# EAGLE design main-pcb-v3.1-r (EAGLE 9.6.2)
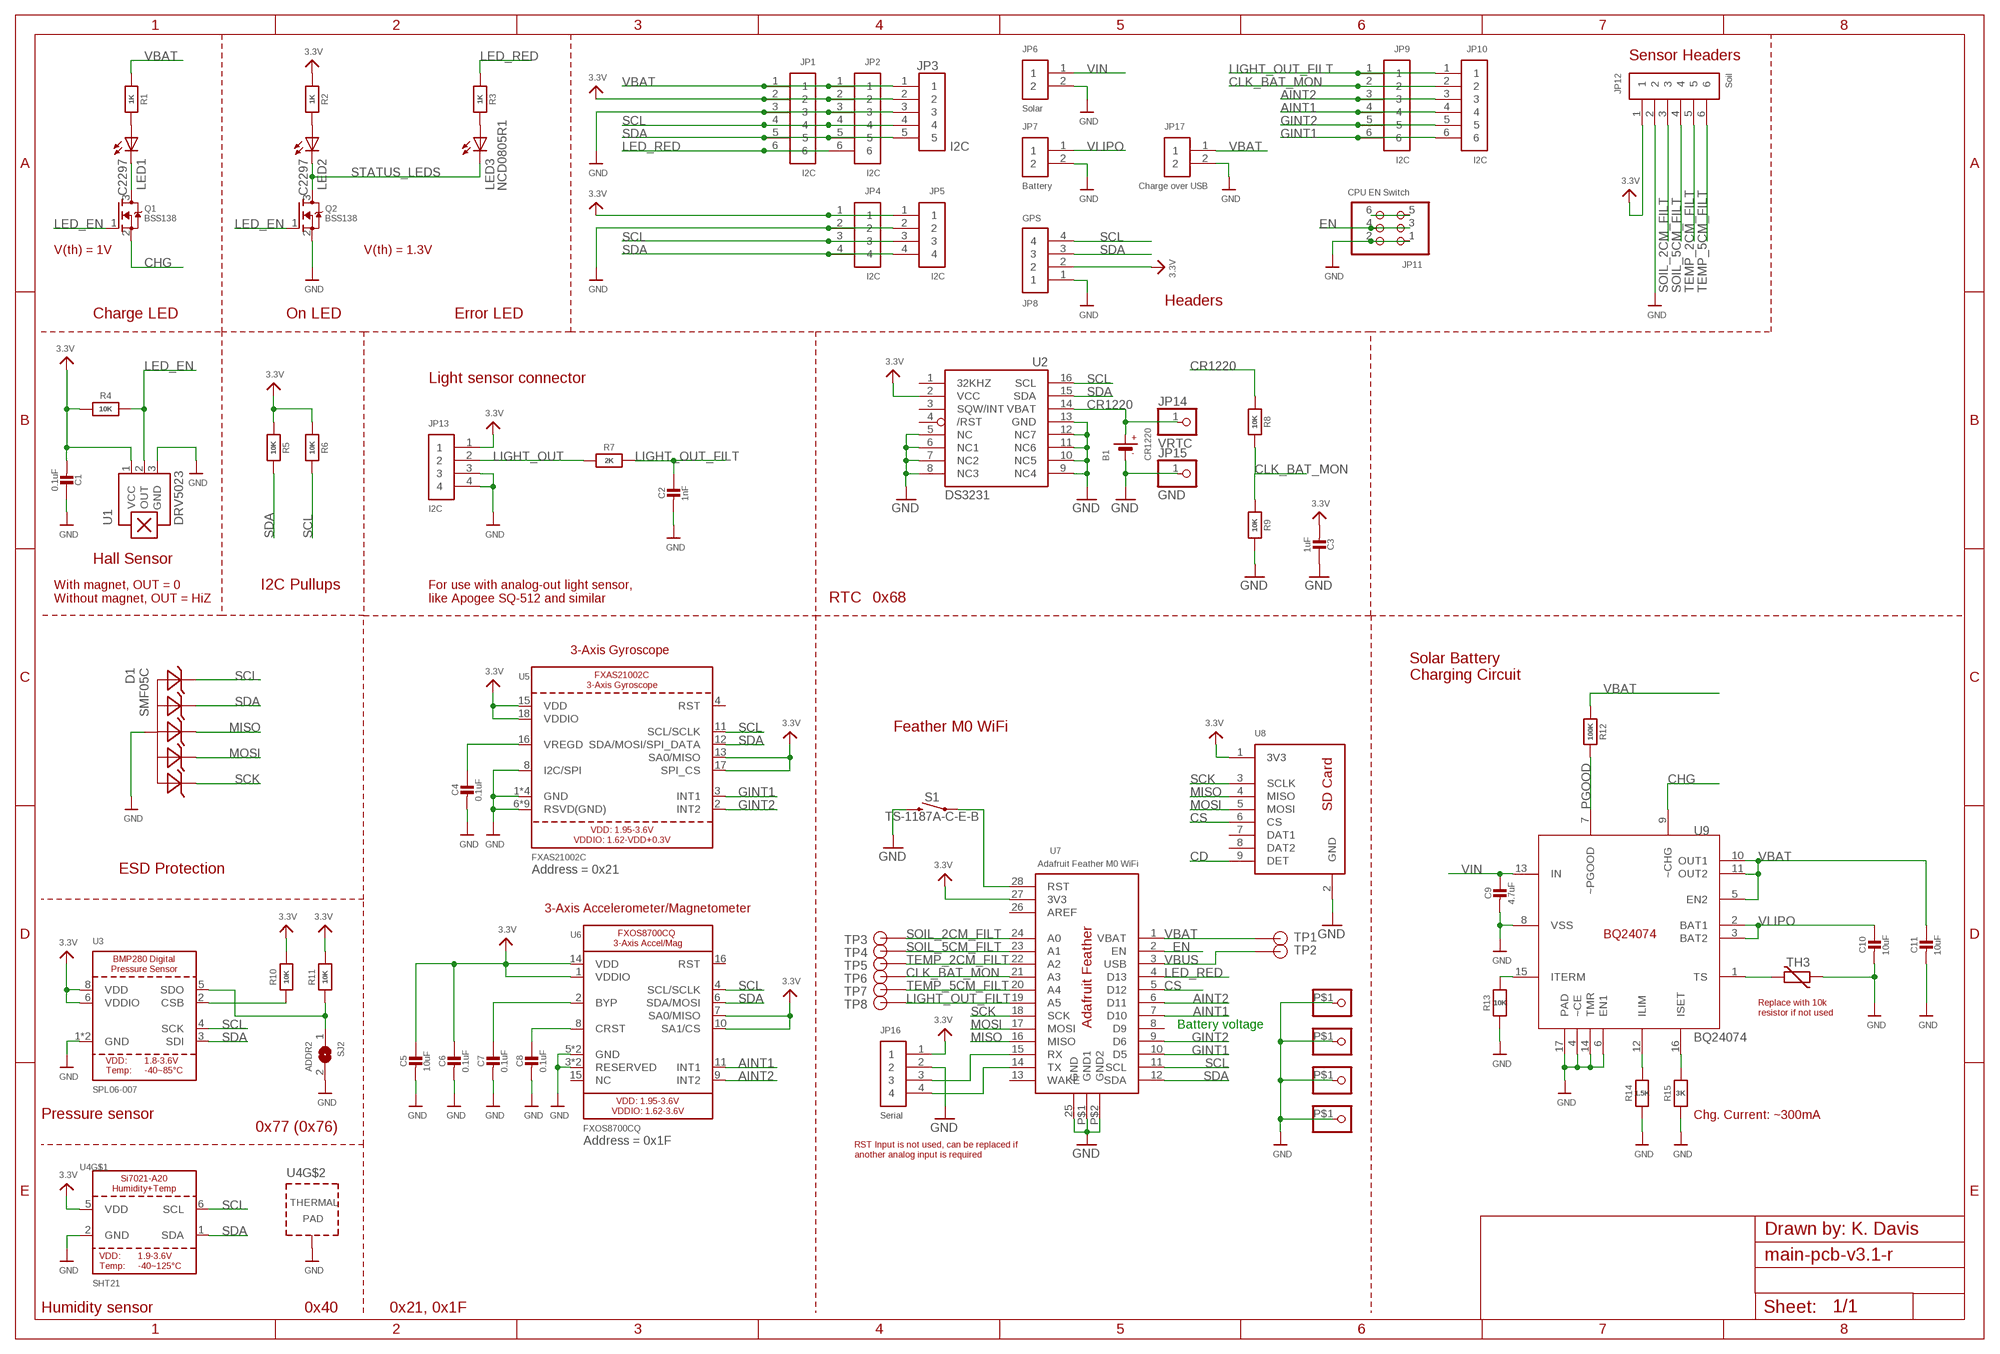
[diagram p0: schematic, sheet 1]

## Parts
B1  CR1220  BATTERYCR1220_2  [CR1220-2]
C1  0.1uF  CAP_CERAMIC0805-NOOUTLINE  [0805-NO]
C2  1nF  CAP_CERAMIC0805-NOOUTLINE  [0805-NO]
C3  1uF  CAP_CERAMIC0805-NOOUTLINE  [0805-NO]
C4  0.1uF  CAP_CERAMIC0805-NOOUTLINE  [0805-NO]
C5  10uF  CAP_CERAMIC0805-NOOUTLINE  [0805-NO]
C6  0.1uF  CAP_CERAMIC0805-NOOUTLINE  [0805-NO]
C7  0.1uF  CAP_CERAMIC0805-NOOUTLINE  [0805-NO]
C8  0.1uF  CAP_CERAMIC0805-NOOUTLINE  [0805-NO]
C9  4.7uF  CAP_CERAMIC0805-NOOUTLINE  [0805-NO]
C10  10uF  CAP_CERAMIC0805-NOOUTLINE  [0805-NO]
C11  10uF  CAP_CERAMIC0805-NOOUTLINE  [0805-NO]
D1  SMF05C  [SC70-6]
JP1  I2C  61300611121  [61300611121]
JP2  I2C  61300611121  [61300611121]
JP3  I2C  61300511121  [61300511121]
JP4  I2C  61300411121  [61300411121]
JP5  I2C  61300411121  [61300411121]
JP6  Solar  JST-2  [JST-2]
JP7  Battery  JST-2  [JST-2]
JP8  GPS  JST-4  [JST-4]
JP9  I2C  61300611121  [61300611121]
JP10  I2C  61300611121  [61300611121]
JP11  CPU EN Switch  PINHD-2X3  [2X03]
JP12  Soil  61300611121  [61300611121]
JP13  I2C  61300411121  [61300411121]
JP14  VRTC  HEADER-1X1ROUND  [1X01_ROUND]
JP15  GND  HEADER-1X1ROUND  [1X01_ROUND]
JP16  Serial  61300411121  [61300411121]
JP17  Charge over USB  JST-2  [JST-2]
LED1  C2297  LEDCHIPLED_0805  [CHIPLED_0805]
LED2  C2297  LEDCHIPLED_0805  [CHIPLED_0805]
LED3  NCD0805R1  LEDCHIPLED_0805  [CHIPLED_0805]
Q1  BSS138  MOSFET-NWIDE  [SOT23-WIDE]
Q2  BSS138  MOSFET-NWIDE  [SOT23-WIDE]
R1  1K  RESISTOR_0603_NOOUT  [0603-NO]
R2  1K  RESISTOR_0603_NOOUT  [0603-NO]
R3  1K  RESISTOR_0603_NOOUT  [0603-NO]
R4  10K  RESISTOR_0603_NOOUT  [0603-NO]
R5  10K  RESISTOR_0603_NOOUT  [0603-NO]
R6  10K  RESISTOR_0603_NOOUT  [0603-NO]
R7  2K  RESISTOR_0603_NOOUT  [0603-NO]
R8  10K  RESISTOR_0603_NOOUT  [0603-NO]
R9  10K  RESISTOR_0603_NOOUT  [0603-NO]
R10  10K  RESISTOR_0603_NOOUT  [0603-NO]
R11  10K  RESISTOR_0603_NOOUT  [0603-NO]
R12  100K  RESISTOR_0603_NOOUT  [0603-NO]
R13  10K  RESISTOR0805_NOOUTLINE  [0805-NO]
R14  1.5K  RESISTOR0805_NOOUTLINE  [0805-NO]
R15  3K  RESISTOR0805_NOOUTLINE  [0805-NO]
S1  TS-1187A-C-E-B  MOMENTARY-SWITCH-SPST-SMD-5.2MM  [TACTILE_SWITCH_SMD_5.2MM]
SJ2  ADDR2  SOLDERJUMPER  [SOLDERJUMPER_ARROW_NOPASTE]
TH3  VARISTORCN1206  [CT/CN1206]
TP1  TP  [TP_50MIL_CIRC]
TP2  TP  [TP_50MIL_CIRC]
TP3  TP  [TP_50MIL_CIRC]
TP4  TP  [TP_50MIL_CIRC]
TP5  TP  [TP_50MIL_CIRC]
TP6  TP  [TP_50MIL_CIRC]
TP7  TP  [TP_50MIL_CIRC]
TP8  TP  [TP_50MIL_CIRC]
U1  DRV5023  [SOT-23]
U2  DS3231/SO  [SO16W]
U3  SPL06-007  BMP280_COMBO  [BMX280_COMBO]
U4  SHT21  SI7021-A20  [DFN6_3X3_SI]
U5  FXAS21002C  GYRO_FXAS21002C  [QFN24_4MM_FREESCALE_7X5]
U6  FXOS8700CQ  ACCEL_MAG_FXOS8700CQ  [QFN16_3MM_FREESCALE_5X3]
U7  Adafruit Feather M0 WiFi  FEATHER  [FEATHER]
U8  SDCARD2  [SDCARD2]
U9  BQ24074  [VQFN-16_3MM]
U$1  MOUNTING  [MOUNTING]
U$17  MOUNTING  [MOUNTING]
U$19  MOUNTING  [MOUNTING]
U$21  MOUNTING  [MOUNTING]

## Nets
3.3V: C1.2 C3.2 C5.1 C6.1 JP1.2 JP2.2 JP3.2 JP4.1 JP5.1 JP8.2 JP12.1 JP13.1 JP16.1 R2.1 R4.1 R5.1 R6.1 R10.2 R11.2 U1.1(VCC) U2.2(VCC) U3.6(VDDIO) U3.8(VDD) U4.5(VDD) U5.13(SA0/MISO) U5.15(VDD) U5.17(SPI_CS) U5.18(VDDIO) U6.1(VDDIO) U6.7(SA0/MISO) U6.10(SA1/CS) U6.14(VDD) U7.27(3V3) U8.1(3V3)
AINT1: JP9.4 JP10.4 U6.11(INT1) U7.7(D10)
AINT2: JP9.3 JP10.3 U6.9(INT2) U7.6(D11)
CD: U8.9(DET)
CHG: Q1.2(S) U9.9(~CHG)
CLK_BAT_MON: JP9.2 JP10.2 R8.2 R9.1 TP6.1(TP) U7.21(A3)
CR1220: B1.+ JP14.1 R8.1 U2.14(VBAT)
CS: U7.5(D12) U8.6(CS)
EN: JP11.3 JP11.4 U7.2(EN)
GINT1: JP9.6 JP10.6 U5.3(INT1) U7.10(D5)
GINT2: JP9.5 JP10.5 U5.2(INT2) U7.9(D6)
GND: B1.- C1.1 C2.2 C3.1 C4.2 C5.2 C6.2 C7.2 C8.2 C9.2 C10.2 C11.2 D1.2(A) JP1.3 JP2.3 JP3.3 JP4.2 JP5.2 JP6.2 JP7.2 JP8.1 JP11.1 JP11.2 JP12.2 JP13.3 JP13.4 JP15.1 JP16.2 JP17.2 Q2.2(S) R9.2 R13.1 R14.1 R15.1 S1.3 SJ2.2 TH3.2 U1.3(GND) U2.5(NC) U2.6(NC1) U2.7(NC2) U2.8(NC3) U2.9(NC4) U2.10(NC5) U2.11(NC6) U2.12(NC7) U2.13(GND) U3.1(GND) U3.7(GND) U4.2(GND) U4.PAD(TP) U5.1(GND) U5.5(GND) U5.6(RSVD(GND)) U5.7(RSVD(GND)) U5.8(I2C/SPI) U5.9(RSVD(GND)) U5.10(RSVD(GND)) U5.14(GND) U5.19(GND) U5.20(RSVD(GND)) U5.21(RSVD(GND)) U5.22(RSVD(GND)) U5.23(RSVD(GND)) U5.24(RSVD(GND)) U6.3(RESERVED) U6.5(GND) U6.12(GND) U6.13(RESERVED) U7.25(GND) U7.P$1(GND1) U7.P$2(GND2) U8.2(GND) U9.4(~CE) U9.6(EN1) U9.8(VSS) U9.14(TMR) U9.17(PAD) U$1.P$1 U$17.P$1 U$19.P$1 U$21.P$1
ITERM: R13.2 U9.15(ITERM)
LED1: LED1.C Q1.3(D)
LED_EN: Q1.1(G) Q2.1(G) R4.2 U1.2(OUT)
LED_RED: JP1.6 JP2.6 R3.1 U7.4(D13)
LIGHT_OUT: JP13.2 R7.1
LIGHT_OUT_FILT: C2.1 JP9.1 JP10.1 R7.2 TP8.1(TP) U7.19(A5)
MISO: D1.4(C3) U7.16(MISO) U8.4(MISO)
MOSI: D1.5(C4) U7.17(MOSI) U8.5(MOSI)
N$1: LED2.A R2.2
N$2: LED3.A R3.2
N$3: R10.1 U3.2(CSB)
N$4: R11.1 SJ2.1 U3.5(SDO)
N$5: JP16.3 U7.15(RX)
N$6: JP11.5 JP11.6
N$9: JP16.4 U7.14(TX)
N$10: TH3.1 U9.1(TS)
N$11: S1.1 U7.28(RST)
N$13: LED1.A R1.2
N$17: R15.2 U9.16(ISET)
N$18: R14.2 U9.12(ILIM)
N$24: C4.1 U5.16(VREGD)
N$26: C7.1 U6.2(BYP)
N$27: C8.1 U6.8(CRST)
PGOOD: R12.2 U9.7(~PGOOD)
SCK: D1.6(C5) U7.18(SCK) U8.3(SCLK)
SCL: D1.1(C1) JP1.4 JP2.4 JP3.4 JP4.3 JP5.3 JP8.4 R6.2 U2.16(SCL) U3.4(SCK) U4.6(SCL) U5.11(SCL/SCLK) U6.4(SCL/SCLK) U7.11(SCL)
SDA: D1.3(C2) JP1.5 JP2.5 JP3.5 JP4.4 JP5.4 JP8.3 R5.2 U2.15(SDA) U3.3(SDI) U4.1(SDA) U5.12(SDA/MOSI/SPI_DATA) U6.6(SDA/MOSI) U7.12(SDA)
SOIL_2CM_FILT: JP12.3 TP3.1(TP) U7.24(A0)
SOIL_5CM_FILT: JP12.4 TP4.1(TP) U7.23(A1)
STATUS_LEDS: LED2.C LED3.C Q2.3(D)
TEMP_2CM_FILT: JP12.5 TP5.1(TP) U7.22(A2)
TEMP_5CM_FILT: JP12.6 TP7.1(TP) U7.20(A4)
VBAT: C11.1 JP1.1 JP2.1 JP3.1 JP17.1 R1.1 R12.1 TP1.1(TP) U7.1(VBAT) U9.5(EN2) U9.10(OUT1) U9.11(OUT2)
VBUS: TP2.1(TP) U7.3(USB)
VIN: C9.1 JP6.1 U9.13(IN)
VLIPO: C10.1 JP7.1 U9.2(BAT1) U9.3(BAT2)
Unconnected: U2.1(32KHZ) U2.3(SQW/INT) U2.4(/RST) U5.4(RST) U6.15(NC) U6.16(RST) U7.8(D9) U7.13(WAKE) U7.26(AREF) U8.7(DAT1) U8.8(DAT2)

## Notes on the sheet
- Sensor Headers
- V(th) = 1V | V(th) = 1.3V
- Headers
- Charge LED | On LED | Error LED
- Light sensor connector
- Hall Sensor
- I2C Pullups
- With magnet, OUT = 0
  Without magnet, OUT = HiZ
- For use with analog-out light sensor,
  like Apogee SQ-512 and similar
- RTC | 0x68
- 3-Axis Gyroscope
- Solar Battery
  Charging Circuit
- Feather M0 WiFi
- ESD Protection | Address = 0x21
- 3-Axis Accelerometer/Magnetometer
- Replace with 10k
  resistor if not used
- Battery voltage
- Pressure sensor | Chg. Current: ~300mA
- 0x77 (0x76)
- Address = 0x1F
- RST Input is not used, can be replaced if
  another analog input is required
- Drawn by: K. Davis
- Humidity sensor | 0x40 | 0x21, 0x1F

## Library data of the parts
B1 = microbuilder:BATTERY: CR1220 SMT - Digikey: 3001K-ND CD2032 BAT-HLD-001 - Digikey: BAT-HLD-001-ND
C1-C11 = microbuilder:CAP_CERAMIC: Ceramic Capacitors For new designs, use the packages preceded by an '_' character since they are more reliable: The following footprints should be used on most boards: _0402 - Standard footprint for regular board layouts _0603 - Standard footprint for regular board layouts _0805 - Standard footprint for regular board layouts _1206 - Standard footprint for regular board layouts For extremely tight-pitch boards where space is at a premium, the following 'micro-pitch' footprints can be used (smaller pads, no silkscreen outline, etc.): _0402MP - Micro-pitch footprint for very dense/compact boards _0603MP - Micro-pitch footprint for very dense/compact boards _0805MP - Micro-pitch footprint for very dense/compact boards _1206MP - Micro-pitch footprint for very dense/compact boards
D1 = TVS-Diode-SMF05C:SMF05C; AVAILABILITY: Unavailable; MF: ON Semiconductor; MP: SMF05C; PACKAGE: SOT-363 ON Semiconductor; PRICE: None
JP1 JP2 JP9 JP10 JP12 = EarthPodLib:61300611121: CONN HEADER VERT 5POS 2.54MM Manufacturer's datasheet <https://katalog.we-online.de/em/datasheet/6130xx11121.pdf>; CREATED_BY: PCBLayout.com; DIGI_KEY_PART_NUMBER: 732-5318-ND; MANUFACTURER: Wurth Electronics Inc.; MPN: 61300511121
JP3 = Headers:61300511121: CONN HEADER VERT 5POS 2.54MM Manufacturer's datasheet <https://katalog.we-online.de/em/datasheet/6130xx11121.pdf>; CREATED_BY: PCBLayout.com; DIGI_KEY_PART_NUMBER: 732-5318-ND; MANUFACTURER: Wurth Electronics Inc.; MPN: 61300511121
JP4 JP5 JP13 JP16 = Headers:61300411121: CONN HEADER VERT 4POS 2.54MM Manufacturer's datasheet <https://katalog.we-online.de/em/datasheet/6130xx11121.pdf>; CREATED_BY: PCBLayout.com; DIGI_KEY_PART_NUMBER: 732-5317-ND; MANUFACTURER: Wurth Electronics Inc.; MPN: 61300411121
JP6 JP7 JP17 = EarthPodLib:JST-2
JP8 = EarthPodLib:JST-4
JP11 = pinhead:PINHD-2X3: PIN HEADER
JP14 JP15 = microbuilder:HEADER-1X1: PIN HEADER
LED1-LED3 = adafruit:LED: LED OSRAM: - CHIPLED LG R971, LG N971, LY N971, LG Q971, LY Q971, LO R971, LY R971 LH N974, LH R974 LS Q976, LO Q976, LY Q976 LO Q996 - Hyper CHIPLED LW Q18S LB Q993, LB Q99A, LB R99A - SideLED LS A670, LO A670, LY A670, LG A670, LP A670 LB A673, LV A673, LT A673, LW A673 LH A674 LY A675 LS A676, LA A676, LO A676, LY A676, LW A676 LS A679, LY A679, LG A679 - Hyper Micro SIDELED® LS Y876, LA Y876, LO Y876, LY Y876 LT Y87S - SmartLED LW L88C, LW L88S LB L89C, LB L89S, LG L890 LS L89K, LO L89K, LY L89K LS L896, LA L896, LO L896, LY L896 - TOPLED LS T670, LO T670, LY T670, LG T670, LP T670 LSG T670, LSP T670, LSY T670, LOP T670, LYG T670 LG T671, LOG T671, LSG T671 LB T673, LV T673, LT T673, LW T673 LH T674 LS T676, LA T676, LO T676, LY T676, LB T676, LH T676, LSB T676, LW T676 LB T67C, LV T67C, LT T67C, LS T67K, LO T67K, LY T67K, LW E67C LS E67B, LA E67B, LO E67B, LY E67B, LB E67C, LV E67C, LT E67C LW T67C LS T679, LY T679, LG T679 LS T770, LO T770, LY T770, LG T770, LP T770 LB T773, LV T773, LT T773, LW T773 LH T774 LS E675, LA E675, LY E675, LS T675 LS T776, LA T776, LO T776, LY T776, LB T776 LHGB T686 LT T68C, LB T68C - Hyper Mini TOPLED® LB M676 - Mini TOPLED Santana® LG M470 LS M47K, LO M47K, LY M47K Source: http://www.osram.convergy.de/
Q1 Q2 = microbuilder:MOSFET-N: N-Channel Mosfet LEGEND VDS: Voltage Drain-Source ID: Drain Current RDS(ON): Drain-Source On-State Resistance VGS(TH): Gate-Source Threshold Voltage CISS: Drain-Source Input Capacitance SOT-23 Name VDS ID RDS(ON) VGS(TH) CISS Order Number 2N7002E 60V 260mA 2.5 Ohm 2.5V @ 250uA 26.7pF @ 25V 2N7002ET1GOSTR-ND BSH103 30V 850mA 400 mOhm 400mV @ 1mA 83pF @ 24V BSH103,235-ND BSS138 60V 320mA 1.6 Ohm 1.5V @ 250uA 50pF @ 10V Mouser: 771-BSS138PW115 DMN2075U-7 20V 4.2A 38 mOhm 1V @ 250 uA 594.3pF @ 10V DMN2075U-7DICT-ND * BSS138 good choice for I2C level-shifting POWERPAK 1212-8 Name VDS ID RDS(ON) VGS(TH) CISS Order Number Si7308DN 60V 6A 58 mOhm 3V @ 250uA 665pF @ 15V SI7308DN-T1-E3CT-ND
R1-R15 = microbuilder:RESISTOR: Resistors For new designs, use the packages preceded by an '_' character since they are more reliable: The following footprints should be used on most boards: _0402 - Standard footprint for regular board layouts _0603 - Standard footprint for regular board layouts _0805 - Standard footprint for regular board layouts _1206 - Standard footprint for regular board layouts For extremely tight-pitch boards where space is at a premium, the following 'micro-pitch' footprints can be used (smaller pads, no silkscreen outline, etc.): _0402MP - Micro-pitch footprint for very dense/compact boards _0603MP - Micro-pitch footprint for very dense/compact boards _0805MP - Micro-pitch footprint for very dense/compact boards _1206MP - Micro-pitch footprint for very dense/compact boards
S1 = SparkFun-Switches:MOMENTARY-SWITCH-SPST: Momentary Switch (Pushbutton) - SPST Normally-open (NO) SPST momentary switches (buttons, pushbuttons). Variants PTH-12MM - 12mm square, through-hole Momentary Pushbutton Switch - 12mm Square <https://www.sparkfun.com/products/9190> (COM-09190) PTH-6.0MM, PTH-6.0MM-KIT - 6.0mm square, through-hole Mini Pushbutton Switch <https://www.sparkfun.com/products/97> (COM-00097) KIT package intended for soldering kit's - only one side of pads' copper is exposed. PTH-RIGHT-ANGLE-KIT - Right-angle, through-hole Right Angle Tactile Button <https://www.sparkfun.com/products/10791> - Used on SparkFun BigTime Watch Kit <https://www.sparkfun.com/products/11734> SMD-12MM - 12mm square, surface-mount Tactile Button - SMD (12mm) <https://www.sparkfun.com/products/12993> (COM-12993) Used on SparkFun PicoBoard <https://www.sparkfun.com/products/11888> SMD-4.5MM - 4.5mm Square Trackball Switch Used on SparkFun Blackberry Trackballer Breakout <https://www.sparkfun.com/products/13169> SMD-4.6MMX2.8MM - 4.60mm x 2.80mm, surface mount Used on SparkFun SAMD21 Mini Breakout <https://www.sparkfun.com/products/13664> SMD-5.2MM, SMD-5.2-REDUNDANT - 5.2mm square, surface-mount Mini Pushbutton Switch - SMD <https://www.sparkfun.com/products/8720> (COM-08720) Used on Arduino Pro Mini <https://www.sparkfun.com/products/11114> REDUNDANT package connects both switch circuits together SMD-6.0X3.5MM - 6.0 x 3.5mm, surface mount Momentary Reset Switch SMD <https://www.sparkfun.com/products/8229> (COM-08229) SMD-6.2MM-TALL - 6.2mm square, surface mount Tactile Button - SMD (6mm) <https://www.sparkfun.com/products/12992> Used on SparkFun Digital Sandbox <https://www.sparkfun.com/products/12651> SMD-RIGHT-ANGLE - Right-angle, surface mount Used on SparkFun Block for Intel® Edison - Arduino <https://www.sparkfun.com/products/13036>; PROD_ID: SWCH-08247; SF_SKU: COM-08720
SJ2 = microbuilder:SOLDERJUMPER: SMD Solder JUMPER Solder the two pads together to create a connection, or remove the solder to break it. REFLOW - Use this footprint for solder paste and reflow ovens. WAVE - Use this footprint for hand-soldering (larger pads). CLOSED - Has a trace between the two pads to ensure it is closed by default. The trace needs to be cut to disable the jumper, and can be closed again by creating a solder bridge between the two pads.; BOM: EXCLUDE
TH3 = varistor:VARISTOR: VARISTOR
TP1-TP8 = EarthPodLib:TP
U1 = EarthPodLib:DRV5023: Unipolar Hall Effect Sensor (South)
U2 = adafruit:DS3231
U3 = adafruit_sensor:BMP280: BMP280 - Digital Pressure Sensor Operating Pressure Range: 300-1100 hPa Pressure Resolution: 0.16Pa RMS Noise: 1.3Pa Temperature Resolution: 0.01 C
U4 = microbuilder:SI7021-A20: Si7021-A20 - I2C Humidity and Temperature Sensor VDD: 1.9-3.6V Operating Temperature: -40~125°C +/-3% RH (max) 0..80% RH Humidity Sensor +/-0.4°C (max-, -10~85°C Temperature Sensor 150uA Active, 60nA Standby
U5 = microbuilder:GYRO_FXAS21002C: FXAS21002C - 3 Axis Gyroscope - 250/500/1000/2000dps Range: 250/500/1000/2000 dps Data Rate: 2.5-800Hz Resolution: 16-bits
U6 = microbuilder:ACCEL_MAG_FXOS8700CQ: FX0S8700CQ - 3-Axis Accelerometer and Magnetometer Accel Range: +/-2/4/8 g Accel Data Rate: 1.6-800Hz (400Hz in hybrid mode) Accel Resolution: 14-bits Mag Range: 1200uT Mag Data Rate: 1.6-800Hz (400Hz in hybrid mode) Mag Resolution: 16-bits
U7 = Breakout-Boards:FEATHER
U8 = Breakout-Boards:SDCARD2
U9 = EarthPodLib:BQ24074
U$1 U$17 U$19 U$21 = Breakout-Boards:MOUNTING

## Net classes
1 highpower: width 0.305 mm, drill 0.483 mm
2 lowpower: width 0.254 mm, drill 0.483 mm

## Board
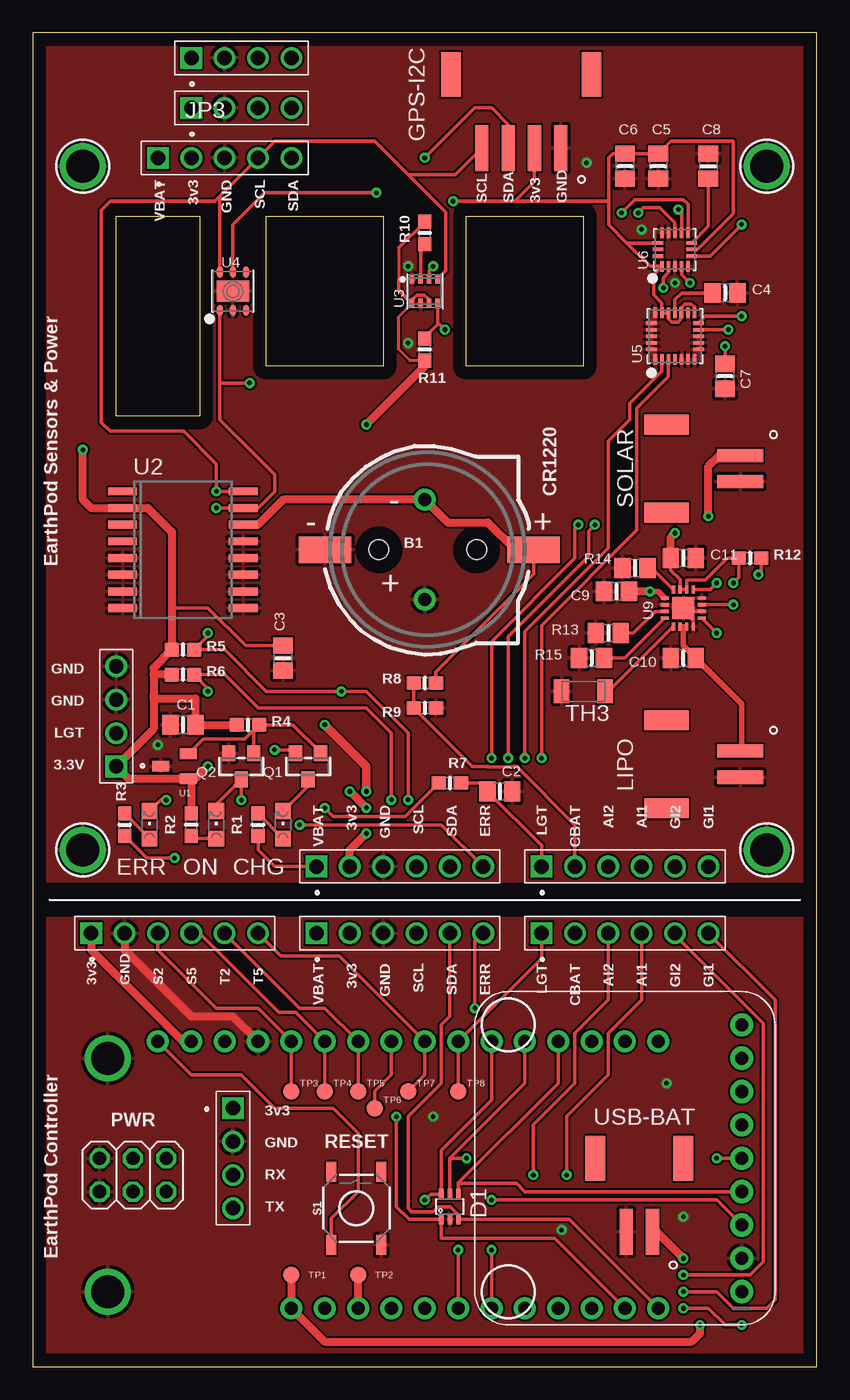
[diagram p1: board, top side]
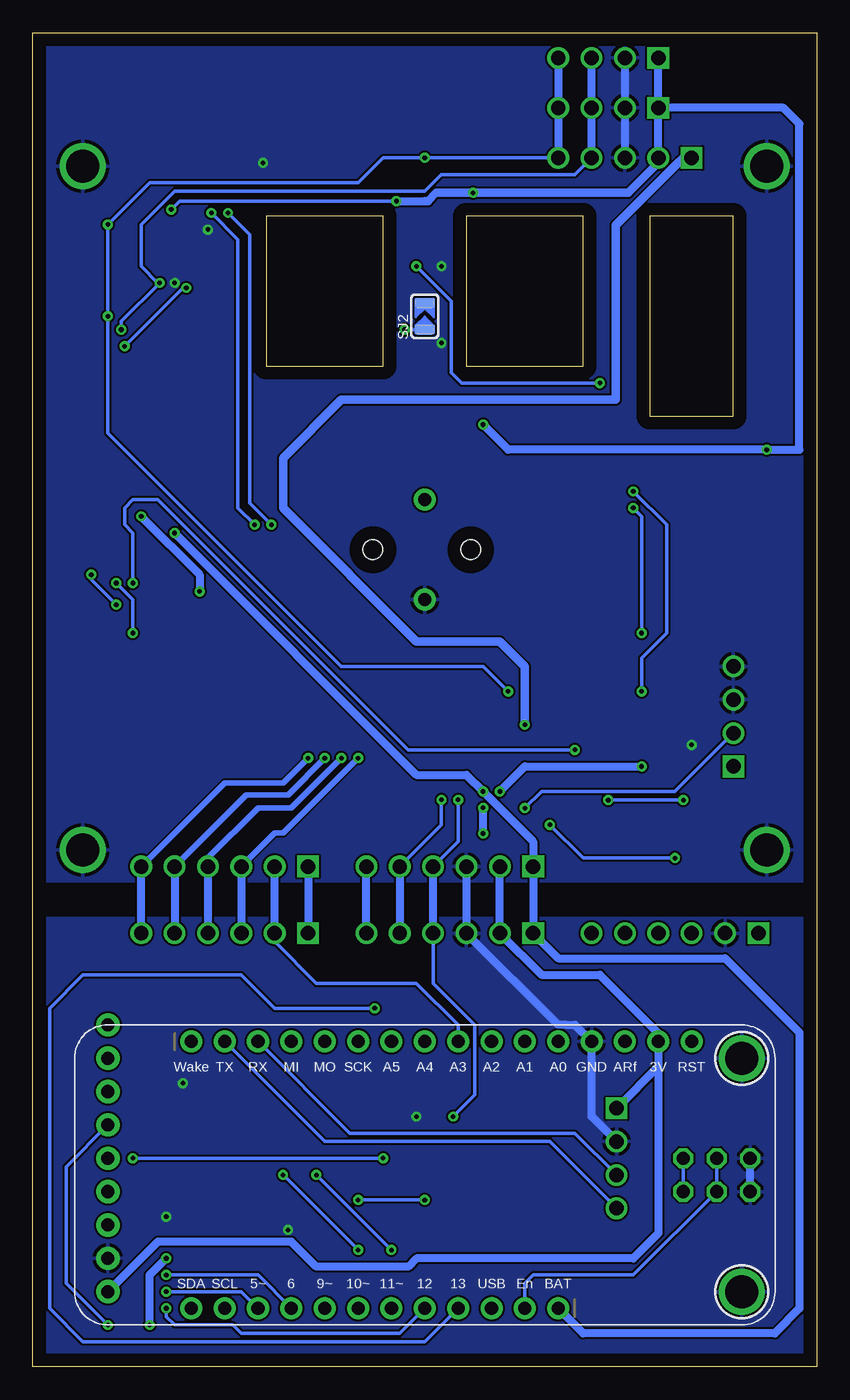
[diagram p2: board, bottom side, seen from below]

Size 59.69 x 101.6 mm. Coordinates in mm from the lower left corner, seen from the top.
Outline: 59.69,0 59.69,101.6 0,101.6 0,0 59.69,0
Outline: 6.35,87.63 12.7,87.63 12.7,72.39 6.35,72.39 6.35,87.63
Outline: 26.67,87.63 26.67,76.2 17.78,76.2 17.78,87.63 26.67,87.63
Outline: 33.02,87.63 41.91,87.63 41.91,76.2 33.02,76.2 33.02,87.63
Copper layers (1*16): Top 0.035mm / dielectric 1.5mm / Bottom 0.035mm
Design rules "default": minimum track width 6mil, minimum drill 0.35mm, track to track 6mil, track to pad 6mil, pad to pad 6mil, via to via 6mil, smd to smd 6mil, copper to edge 40mil, drill to drill 6mil, minimum pad ring 10mil, minimum via ring 8mil, stop-mask expansion 4mil, vias tented up to drill 0mil, thermal gap 10mil
tRestrict: area 0,34.3 to 59.7,36.8
bRestrict: area 0,34.3 to 59.7,36.8

### Footprints (pad centres in the part's own frame; a part is rotated, then mirrored left to right if it is on the bottom)
CR1220-2 = smd 4 x 2: + 8.29,0; - -7.6,0 | hole 1.5: 3.95,0; -3.5,0
0805-NO = smd 1.24 x 1.5: 1 -0.95,0; 2 0.95,0
SC70-6 = smd 0.35 x 0.8: 1 -0.65,-0.95; 2 0,-0.95; 3 0.65,-0.95; 4 0.65,0.95; 5 0,0.95; 6 -0.65,0.95
61300611121 = drill 1.1 square: 1 -6.35,0 | drill 1.1: 2 -3.81,0; 3 -1.27,0; 4 1.27,0; 5 3.81,0; 6 6.35,0
61300511121 = drill 1.1 square: 1 -5.08,0 | drill 1.1: 2 -2.54,0; 3 0,0; 4 2.54,0; 5 5.08,0
61300411121 = drill 1.1 square: 1 -3.81,0 | drill 1.1: 2 -1.27,0; 3 1.27,0; 4 3.81,0
JST-2 = smd 1 x 3.5: 1 2.35,5.6; 2 4.35,5.6 | smd 1.5 x 3.4: 3 0,0; 4 6.7,0
JST-4 = smd 1 x 3.5: 1 2.35,5.6; 2 4.35,5.6; 3 6.35,5.6; 4 8.35,5.6 | smd 1.5 x 3.4: 5 0,0; 6 10.7,0
2X03 = drill 1.016 octagon: 1 -2.54,-1.27; 2 -2.54,1.27; 3 0,-1.27; 4 0,1.27; 5 2.54,-1.27; 6 2.54,1.27
1X01_ROUND = drill 1 pad 1.676: 1 0,0
CHIPLED_0805 = smd 1.2 x 1.2: A 0,-1.05; C 0,1.05
SOT23-WIDE = smd 1 x 1.2: 1 -0.95,-1; 2 0.95,-1; 3 0,1
0603-NO = smd 1.075 x 1: 1 -0.85,0; 2 0.85,0
TACTILE_SWITCH_SMD_5.2MM = smd 1.524 x 0.762: 1 -2.794,1.905; 2 2.794,1.905; 3 -2.794,-1.905; 4 2.794,-1.905
SOLDERJUMPER_ARROW_NOPASTE = smd 0.762 x 1.524: 1 -1.016,0; 2 1.016,0
CT/CN1206 = smd 1.2 x 1.8: 1 -1.65,0; 2 1.65,0
TP_50MIL_CIRC = smd 1.27 x 1.27: 1 0,0
SOT-23 = smd 1.3 x 0.8: 1 -1.05,0.95; 2 -1.05,-0.95; 3 1.05,0
SO16W = smd 0.6 x 2.2: 1 -4.445,-4.6; 2 -3.175,-4.6; 3 -1.905,-4.6; 4 -0.635,-4.6; 5 0.635,-4.6; 6 1.905,-4.6; 7 3.175,-4.6; 8 4.445,-4.6; 9 4.445,4.6; 10 3.175,4.6; 11 1.905,4.6; 12 0.635,4.6; 13 -0.635,4.6; 14 -1.905,4.6; 15 -3.175,4.6; 16 -4.445,4.6
BMX280_COMBO = smd 0.725 x 0.35: 1 0.925,0.975; 2 0.925,0.325; 3 0.925,-0.325; 4 0.925,-0.975; 5 -0.925,-0.975; 6 -0.925,-0.325; 7 -0.925,0.325; 8 -0.925,0.975
DFN6_3X3_SI = smd 0.85 x 0.45: 1 -1.45,1; 2 -1.45,0; 3 -1.45,-1; 4 1.45,-1; 5 1.45,0; 6 1.45,1 | smd 1.6 x 2.5: PAD 0,0
QFN24_4MM_FREESCALE_7X5 = smd 0.8 x 0.275: 1 -1.775,1.5; 2 -1.775,1; 3 -1.775,0.5; 4 -1.775,0; 5 -1.775,-0.5; 6 -1.775,-1; 7 -1.775,-1.5; 13 1.775,-1.5; 14 1.775,-1; 15 1.775,-0.5; 16 1.775,0; 17 1.775,0.5; 18 1.775,1; 19 1.775,1.5 | smd 0.275 x 0.8: 8 -1,-1.775; 9 -0.5,-1.775; 10 0,-1.775; 11 0.5,-1.775; 12 1,-1.775; 20 1,1.775; 21 0.5,1.775; 22 0,1.775; 23 -0.5,1.775; 24 -1,1.775
QFN16_3MM_FREESCALE_5X3 = smd 0.8 x 0.275: 1 -1.275,1; 2 -1.275,0.5; 3 -1.275,0; 4 -1.275,-0.5; 5 -1.275,-1; 9 1.275,-1; 10 1.275,-0.5; 11 1.275,0; 12 1.275,0.5; 13 1.275,1 | smd 0.275 x 0.8: 6 -0.5,-1.275; 7 0,-1.275; 8 0.5,-1.275; 14 0.5,1.275; 15 0,1.275; 16 -0.5,1.275
FEATHER = drill 1 pad 1.676: 1 -8.89,10.16; 2 -6.35,10.16; 3 -3.81,10.16; 4 -1.27,10.16; 5 1.27,10.16; 6 3.81,10.16; 7 6.35,10.16; 8 8.89,10.16; 9 11.43,10.16; 10 13.97,10.16; 11 16.51,10.16; 12 19.05,10.16; 13 19.05,-10.16; 14 16.51,-10.16; 15 13.97,-10.16; 16 11.43,-10.16; 17 8.89,-10.16; 18 6.35,-10.16; 19 3.81,-10.16; 20 1.27,-10.16; 21 -1.27,-10.16; 22 -3.81,-10.16; 23 -6.35,-10.16; 24 -8.89,-10.16; 25 -11.43,-10.16; 26 -13.97,-10.16; 27 -16.51,-10.16; 28 -19.05,-10.16 | drill 2.5 pad 3.2: P$1 -22.86,8.89; P$2 -22.86,-8.89
SDCARD2 = drill 1 pad 1.778: 1 -10.16,0; 2 -7.62,0; 3 -5.08,0; 4 -2.54,0; 5 0,0; 6 2.54,0; 7 5.08,0; 8 7.62,0; 9 10.16,0
VQFN-16_3MM = smd 0.6 x 0.24: 1 -1.4,0.75; 2 -1.4,0.25; 3 -1.4,-0.25; 4 -1.4,-0.75; 9 1.4,-0.75; 10 1.4,-0.25; 11 1.4,0.25; 12 1.4,0.75 | smd 0.24 x 0.6: 5 -0.75,-1.4; 6 -0.25,-1.4; 7 0.25,-1.4; 8 0.75,-1.4; 13 0.75,1.4; 14 0.25,1.4; 15 -0.25,1.4; 16 -0.75,1.4 | smd 1.68 x 1.68: 17 0,0
MOUNTING = drill 2.5 pad 3.2: P$1 0,0

### Placement (x,y rotation side)
B1  29.84,62.23 0 top
C1  11.43,48.9 0 top
C2  35.56,43.81 0 top
C3  19.05,53.98 90 top
C4  52.7,81.79 0 top
C5  47.62,91.44 270 top
C6  45.09,91.44 270 top
C7  52.7,75.44 270 top
C8  51.44,91.44 90 top
C9  44.45,59.05 180 top
C10  49.53,53.98 180 top
C11  49.53,61.59 0 top
D1  31.75,12.19 0 top
JP1  27.94,33.02 0 top
JP2  27.94,38.1 0 top
JP3  14.61,92.08 0 top
JP4  15.88,95.89 0 top
JP5  15.88,99.69 0 top
JP6  48.26,71.75 270 top
JP7  48.26,49.24 270 top
JP8  42.55,98.42 180 top
JP9  45.09,33.02 0 top
JP10  45.09,38.1 0 top
JP11  7.62,14.61 0 top
JP12  10.79,33.02 0 top
JP13  6.35,49.53 90 top
JP14  29.84,66.04 0 top
JP15  29.84,58.42 0 top
JP16  15.24,15.88 270 top
JP17  49.53,15.88 180 top
LED1  19.05,41.27 0 top
LED2  13.97,41.27 0 top
LED3  8.89,41.27 0 top
Q1  20.95,45.72 180 top
Q2  15.88,45.72 180 top
R1  17.14,41.27 90 top
R2  12.06,41.27 270 top
R3  6.99,41.27 90 top
R4  16.38,48.9 0 top
R5  11.43,54.61 0 top
R6  11.43,52.7 0 top
R7  31.75,44.45 0 top
R8  29.84,52.07 180 top
R9  29.84,50.16 0 top
R10  29.84,86.36 90 top
R11  29.84,77.47 270 top
R12  54.61,61.59 0 top
R13  43.81,55.88 0 top
R14  45.85,60.83 0 top
R15  42.55,53.98 0 top
S1  24.64,12.06 90 top
SJ2  29.84,80.01 90 bottom
TH3  41.91,51.44 180 top
TP1  19.68,6.99 0 top
TP2  24.77,6.99 0 top
TP3  19.68,20.95 0 top
TP4  22.23,20.95 0 top
TP5  24.77,20.95 0 top
TP6  26.04,19.68 0 top
TP7  28.57,20.95 0 top
TP8  32.38,20.95 0 top
U1  10.79,45.72 180 top
U2  11.43,62.23 270 top
U3  29.84,81.92 90 top
U4  15.24,81.92 90 top
U5  48.9,78.49 90 top
U6  48.9,85.09 90 top
U7  28.57,14.61 180 bottom
U8  53.98,15.88 90 top
U9  49.53,57.78 90 top
U$1  55.88,39.37 0 top
U$17  3.81,39.37 0 top
U$19  55.88,91.44 0 top
U$21  3.81,91.44 0 top

### Tracks (layer width: path | path; a pad name or v marks a point on that pad's centre or on a via)
3.3V  (via drill 0.35)
  Top 0.229: 27.88,85.22 27.88,82.8 | 29.15,81.53 29.14,81.54 | U3.8 27.81,79.93 27.81,77.53 28.73,76.62 R11.2
  Top 0.254: U6.10 49.4,87.89 v49.15,88.14 | U4.5 15.24,87 17.65,89.41 v26.16,89.41 | U6.7 50.6,85.09 53.34,87.83 53.34,93.34 48.58,93.34 C5.1 C6.1 44.16,92.39 43.84,92.08 43.84,88.9 | U6.14 45.22,85.59 | 43.84,88.9 43.84,86.97 45.22,85.59 | 49.4,80.69 49.35,80.65 49.35,79.78 49.15,79.58 48.64,79.58 48.4,79.83 U5.17 U5.18 47.9,81.01 47.26,81.64 47.26,83.18 U6.1 46.99,83.81 45.22,85.59 | U5.13 50.4,80.69 50.15,80.94 49.64,80.94 49.4,80.69 | U5.15 49.4,80.69 | v32,88.77 36.7,88.77 | R10.2 29.84,87.19 27.88,85.22 | U3.6 30.17,81.27 29.81,81.63 29.23,81.63 29.14,81.54 28.87,81.27 U3.8 27.88,81.98 27.88,82.8 | C3.2 16.2,54.92 13.34,57.78 10.58,57.78 | 36.7,88.77 38.2,90.27 JP8.2 | 36.7,88.77 43.71,88.77 43.84,88.9
  Top 0.61: R4.1 C1.2 12.38,50.9 9.21,50.9 | v3.81,69.85 3.81,66.04 4.45,65.41 U2.2 8.76,65.41 10.58,63.59 10.58,57.78 R5.1 9.21,53.23 9.21,52.7 | 9.21,52.7 9.21,51.12 9.21,50.9 | 9.21,50.9 9.21,48.58 JP13.1 7.3,44.77 U1.1 | R6.1 9.21,52.7 | R11.2 29.84,76.2 v25.4,71.75 | U1.1 12.06,44.55 R2.1 | JP12.1 4.45,31.75 11.43,24.77 U7.27 | JP2.2 24.13,39.37 25.38,40.62 v25.4,40.62 | v25.4,42.57 24.15,43.81 v24.13,43.81 | v13.34,45.72 12.38,44.77 U1.1
  Bottom 0.254: v49.15,88.14 48.51,88.77 v32,88.77
  Bottom 0.61: 12.06,22.86 U7.27 12.06,25.4 16.51,29.84 20.95,29.84 JP1.2 JP2.2 | 12.06,22.86 JP16.1 | 12.06,22.86 12.06,10.16 13.97,8.26 30.48,8.26 31.11,7.62 38.1,7.62 40.01,9.53 50.16,9.53 U8.1 | v25.4,71.75 23.5,69.85 v3.81,69.85 1.32,69.85 1.32,94.67 2.54,95.89 JP4.1 | v32,88.77 29.84,88.77 | 29.59,88.77 28.96,89.41 v26.16,89.41 | JP4.1 JP3.2 12.06,91.69 14.35,89.41 | JP4.1 JP5.1 | v24.13,43.81 22.23,45.72 v13.34,45.72 | v25.4,40.62 v25.4,42.57
  Bottom 0.635: 28.96,89.41 14.35,89.41 | 29.59,88.77 29.84,88.77
AINT1  (via drill 0.35)
  Top 0.254: U7.7 v34.92,8.89 | v40.64,14.61 40.64,19.05 43.81,22.23 43.81,25.4 46.35,27.94 JP9.4 | v36.2,46.35 36.2,55.63 42.32,61.75 42.32,63.66 v42.8,64.14 | v46.1,87.88 46.48,88.27 47.75,88.27 48.9,87.12 U6.11
  Bottom 0.254: v40.64,14.61 v34.92,8.89 | v46.1,87.88 44.07,85.85 44.07,65.41 v42.8,64.14
  Bottom 0.406: v36.2,46.35 40.01,42.55 42.55,42.55 46.35,38.73 JP10.4
  Bottom 0.61: JP10.4 JP9.4
AINT2  (via drill 0.35)
  Top 0.254: U7.6 v32.38,8.89 | v38.1,14.61 38.1,18.41 41.27,21.59 41.27,25.4 43.81,27.94 JP9.3 | v34.92,46.35 34.92,55.24 41.28,61.6 41.28,63.82 41.53,64.08 v41.53,64.14 | v44.83,87.88 45.85,88.9 49.53,88.9 49.9,88.53 U6.9
  Bottom 0.254: v32.38,8.89 v38.1,14.61 | v44.83,87.88 43.18,86.23 43.18,65.79 v41.53,64.14
  Bottom 0.406: v34.92,46.35 40.64,40.64 41.27,40.64 JP10.3
  Bottom 0.61: JP10.3 JP9.3
CHG  (via drill 0.35)
  Top 0.254: U9.9 51.56,59.19 v52.07,59.69 | v18.41,46.99 19.73,46.99 Q1.2
  Bottom 0.254: v18.41,46.99 31.11,46.99 50.16,66.04 52.07,66.04 52.7,65.41 52.7,64.14 52.07,63.5 v52.07,59.69
CLK_BAT_MON
  Top 0.254: R8.2 R9.1 33.44,45.72 33.66,45.72 34.63,45.72 34.65,45.7 36.47,45.7 36.49,45.72 36.83,45.72 41.27,41.27 JP10.2 | U7.21 27.3,22.23 26.04,20.95 TP6.1
  Bottom 0.254: U7.21 27.3,26.04 30.48,29.21 38.1,29.21 41.27,32.38 JP9.2
  Bottom 0.61: JP9.2 JP10.2
CR1220
  Top 0.254: R8.1 30.7,52.92 38.13,60.36 B1.+
  Top 0.61: B1.+ 36.72,62.23 34.65,64.3 31.58,64.3 JP14.1 19.05,66.04 17.14,64.14 U2.14
CS  (via drill 0.35)
  Top 0.254: v49.53,4.45 51.44,4.45 52.7,3.17 v53.98,3.17
  Bottom 0.254: U7.5 31.75,2.54 43.81,2.54 44.45,3.17 48.9,3.17 49.53,3.81 v49.53,4.45 | v53.98,3.17 57.15,6.35 57.15,15.24 U8.6
EN
  Bottom 0.254: U7.2 22.23,6.35 21.59,6.99 13.97,6.99 JP11.3 JP11.4
GINT1  (via drill 0.35)
  Top 0.254: v49.53,5.71 52.07,5.71 53.34,4.45 55.88,4.45 56.52,5.08 56.52,27.94 JP9.6 | v38.73,46.35 38.73,56.45 46,63.71 46,73.03 48.4,75.42 U5.3
  Bottom 0.254: U7.10 43.81,5.71 v49.53,5.71
  Bottom 0.406: v38.73,46.35 40.64,44.45 45.09,44.45 JP10.6
  Bottom 0.61: JP9.6 JP10.6
GINT2  (via drill 0.35)
  Top 0.254: v49.53,6.99 54.61,6.99 55.63,8 55.63,26.16 48.9,32.89 JP9.5 | U5.2 47.9,75.83 45.46,73.4 45.46,72.13 43.81,70.48 43.81,62.36 37.47,56.01 v37.47,46.35
  Bottom 0.254: U7.9 42.55,6.99 v49.53,6.99
  Bottom 0.406: v37.47,46.35 40.26,43.56 43.43,43.56 JP10.5
  Bottom 0.61: JP10.5 JP9.5
GND  (via drill 0.35)
  Top 0.254: U9.6 49.78,57.53 U9.17 49.53,57.53 50.28,56.78 U9.4
  Top 0.61: JP12.2 6.99,31.75 12.06,26.67 15.24,26.67 U7.25
  Bottom 0.61: JP11.1 JP11.2 | JP16.2 17.14,19.05 U7.25 18.41,26.04 19.12,26.04 19.15,26.06 19.71,26.06 JP1.3 JP2.3 | JP5.2 JP4.2 JP3.3
  other vias: 9.53,47.37 28.57,77.98 48.9,82.55 46.35,86.61 28.57,83.82 40.26,10.41 48.26,21.59 30.48,19.05 42.16,91.69 49.53,11.43
  pour Top: -1.27,-1.27 60.96,-1.27 60.96,102.87 -1.27,102.87
  pour Bottom: -2.54,-2.54 62.23,-2.54 62.23,104.14 -2.54,104.14
ITERM
  Top 0.254: U9.15 47.38,57.53 45.72,55.88 R13.2
LED1
  Top 0.254: Q1.3 20.95,44.23 LED1.C
LED_EN
  Top 0.254: R4.2 19.78,48.9 21.91,46.77 Q1.1 | U1.2 12.99,47.81 16.15,47.81 R4.2 | Q2.1 16.82,48.49 R4.2
LED_RED  (via drill 0.35)
  Top 0.254: JP1.6 33.66,32.38 v33.66,27.3 | R3.1 8.68,38.73 v10.79,38.73 | v20.32,41.27 31.11,41.27 JP2.6
  Bottom 0.254: U7.4 29.84,1.91 55.88,1.91 58.42,4.45 58.42,27.3 55.88,29.84 43.81,29.84 41.27,27.3 v33.66,27.3 | v20.32,41.27 17.78,38.73 v10.79,38.73
  Bottom 0.61: JP1.6 JP2.6
LIGHT_OUT  (via drill 0.35)
  Top 0.254: R7.1 28.36,41.91 22.86,41.91 v22.23,42.55
  Bottom 0.254: v22.23,42.55 20.95,43.81 10.79,43.81 JP13.2
LIGHT_OUT_FILT
  Top 0.254: TP8.1 U7.19 38.73,31.11 JP9.1 | R7.2 33.98,44.45 C2.1 38.73,39.69 JP10.1
  Bottom 0.61: JP10.1 JP9.1
MISO
  Top 0.254: D1.4 32.4,13.97 | 32.4,13.97 32.4,13.98 40.01,21.59 U7.16 | U8.4 37.47,13.34 36.83,13.97 32.4,13.97
MOSI  (via drill 0.35)
  Top 0.254: D1.5 31.75,15.88 | 31.75,15.88 37.47,21.59 U7.17 | v33.02,15.88 31.75,15.88 | U8.5 v52.07,15.88
  Bottom 0.254: v33.02,15.88 v52.07,15.88
N$1
  Top 0.254: LED2.A 12.27,40.23 R2.2
N$2
  Top 0.254: R3.2 LED3.A
N$3
  Top 0.254: U3.2 29.52,85.19 R10.1
N$4  (via drill 0.35)
  Top 0.229: 30.8,79.38 30.8,79.57 31.05,79.31 v31.37,78.99
  Top 0.254: R11.1 29.84,78.42 30.8,79.38 | 31.05,79.31 30.82,79.54 U3.5
  Bottom 0.254: SJ2.1 v31.37,78.99
N$5
  Bottom 0.254: JP16.3 18.41,17.78 35.56,17.78 U7.15
N$6
  Bottom 0.254: JP11.5 JP11.6
N$9
  Bottom 0.254: JP16.4 20.32,17.14 37.47,17.14 U7.14
N$10
  Top 0.254: U9.1 43.83,51.44 TH3.1
N$11
  Top 0.254: S1.1 22.73,11.3 24.77,13.34 24.77,17.78 22.86,19.68 18.41,19.68 15.88,22.23 12.06,22.23 U7.28
N$13
  Top 0.254: R1.2 LED1.A
N$17
  Top 0.254: U9.16 45.07,53.98 R15.2
N$18
  Top 0.254: R14.2 47.13,60.83 U9.12
N$24
  Top 0.254: C4.1 49.4,81.79 48.9,81.28 U5.16
N$26  (via drill 0.35)
  Top 0.254: U6.2 48.4,83.32 48.01,82.93 v48.01,82.17 | C7.1 v52.7,77.72
  Bottom 0.254: v52.7,77.72 48.26,82.17 v48.01,82.17
N$27
  Top 0.254: U6.8 51.44,86.86 C8.1
PGOOD  (via drill 0.35)
  Top 0.254: U9.7 v53.34,58.03 v53.34,58.04 | v55.24,60.33 55.46,60.54 R12.2
  Bottom 0.254: v53.34,58.04 55.24,59.94 v55.24,60.33
SCK  (via drill 0.35)
  Top 0.254: U7.18 34.92,20.32 31.1,16.5 D1.6 30.29,13.14 v29.84,12.7 | v34.92,12.7 52.07,12.7 U8.3
  Bottom 0.254: v34.92,12.7 v29.84,12.7
SCL  (via drill 0.35)
  Top 0.254: D1.1 31.11,11.23 | 31.11,11.23 31.11,9.78 39.75,9.78 U7.11 | 31.11,11.23 28.65,11.23 27.69,12.19 v27.69,19.05 | U4.6 14.24,89.17 | v27.3,43.18 27.3,48.26 25.4,50.16 17.14,50.16 14.61,52.7 R6.2 13.34,51.65 v13.34,51.44 | 14.24,89.17 13.84,88.77 5.88,88.77 5.21,88.1 5.21,71.92 5.88,71.25 11.48,71.25 13.97,68.75 v13.97,66.67 U2.16 | U3.4 31.45,83.47 31.45,87.92 28.57,90.81 | U6.4 49.4,83.18 50.02,82.55 v50.04,82.55 | v52.96,78.99 v52.95,78.99 U5.11 | 28.57,90.81 26.04,93.34 18.41,93.34 JP3.4 14.24,89.17 | JP8.4 32.17,90.81 28.57,90.81
  Bottom 0.254: v13.34,51.44 13.34,53.98 11.43,55.88 11.43,64.14 v13.97,66.67 | v52.96,78.99 52.96,79.63 v50.04,82.55 50.16,82.55 51.44,83.82 51.44,87 48.9,89.53 29.84,89.53 28.57,90.81 18.41,90.81 JP3.4 | JP1.4 29.21,29.21 26.04,26.04 26.04,20.7 v27.69,19.05 | JP2.4 27.3,40.01 v27.3,43.18
  Bottom 0.61: JP1.4 JP2.4 | JP3.4 JP4.3 JP5.3
SDA  (via drill 0.35)
  Top 0.254: U7.12 40.83,11.24 D1.3 32.4,11.56 31.77,12.19 30.86,12.19 30.48,11.81 28.83,11.81 28.57,12.06 28.57,19.05 31.11,21.59 31.11,26.04 31.75,26.67 JP1.5 | v28.57,43.18 28.57,48.26 25.4,51.44 v23.5,51.44 17.78,51.44 14.61,54.61 R5.2 13.34,55.66 v13.34,55.88 | U4.1 14.24,74.93 | 14.24,74.93 14.24,72.12 18.41,67.94 18.41,66.67 17.14,65.41 U2.15 v13.97,65.41 | v53.98,87 51.57,84.59 U6.6 | U5.12 51.19,80.01 v53.98,80.01 | v16.51,74.93 14.24,74.93 | v30.48,83.82 30.17,83.51 U3.3 | JP8.3 36.2,94.61 34.92,95.89 33.66,95.89 v29.84,92.08
  Bottom 0.254: v13.34,55.88 13.34,64.77 v13.97,65.41 | v30.48,83.82 27.81,81.15 27.81,75.73 27.02,74.93 v16.51,74.93 | v23.5,51.44 25.4,53.34 36.2,53.34 53.98,71.12 v53.98,80.01 v53.98,87 50.8,90.17 34.92,90.17 33.02,92.08 v29.84,92.08 JP3.5 | JP2.5 28.57,41.27 v28.57,43.18
  Bottom 0.61: JP2.5 JP1.5 | JP5.4 JP4.4 JP3.5
SOIL_2CM_FILT
  Top 0.254: TP3.1 U7.24 17.14,27.3 13.97,27.3 9.53,31.75 JP12.3
SOIL_5CM_FILT
  Top 0.254: TP4.1 U7.23 20,26.99 18.73,26.99 12.7,33.02 JP12.4
STATUS_LEDS  (via drill 0.35)
  Top 0.254: LED2.C 13.97,42.81 Q2.3 v15.88,43.16 | LED3.C 9.72,43.16 v10.16,43.16
  Bottom 0.254: v10.16,43.16 10.18,43.18 15.88,43.18 v15.88,43.16
TEMP_2CM_FILT
  Top 0.254: TP5.1 U7.22 22.23,27.3 20.32,27.3 JP12.5
TEMP_5CM_FILT
  Top 0.254: TP7.1 29.84,22.23 U7.20 23.32,31.29 18.87,31.29 JP12.6
VBAT  (via drill 0.35)
  Top 0.254: C11.1 48.58,60.64 49.28,59.94 U9.11 U9.10 49.78,59.93 51.22,59.93 52.88,61.59 R12.1 53.76,60.11 v53.34,59.69 | U9.5 52.07,55.9 v52.07,55.88 | R1.1 17.14,39.37 18.41,38.1 JP2.1
  Top 0.61: C11.1 48.58,63.18 v48.9,63.49 v48.9,63.5 | TP1.1 U7.1 22.23,1.91 50.16,1.91 50.8,2.54 v50.8,3.17 | v49.53,8.26 47.51,10.28 JP17.1
  Top 0.635: v22.23,48.9 25.4,45.72 v25.4,43.81
  Bottom 0.254: v52.07,55.88 52.07,58.42 v53.34,59.69
  Bottom 0.61: v48.9,63.5 30.48,45.09 26.67,45.09 v25.4,43.81 21.59,40.01 JP2.1 JP1.1 19.68,31.11 6.99,31.11 1.32,25.45 1.32,4.45 3.17,2.59 3.17,2.54 17.78,2.54 U7.1 | JP3.1 10.16,92.08 10.41,91.82 | v50.8,3.17 50.8,6.99 v49.53,8.26
  Bottom 0.635: 10.41,91.82 15.3,86.93 15.3,73.66 36.2,73.66 40.64,69.22 40.64,65.41 30.48,55.24 24.13,55.24 22.23,53.34 v22.23,48.9
VBUS
  Top 0.61: U7.3 TP2.1
VIN  (via drill 0.35)
  Top 0.406: v46.99,59.05 47.61,59.05 U9.13
  Top 0.61: v46.99,59.05 C9.1 | v51.44,64.77 51.44,68.58 52.26,69.41 JP6.1
  Bottom 0.61: v51.44,64.77 46.99,60.33 v46.99,59.05
VLIPO
  Top 0.254: U9.2 49.53,56.38 U9.3 U9.2
  Top 0.406: 49.53,56.38 49.53,54.92 C10.1 53.98,50.48 53.98,47.01 JP7.1

### Text on the board
tNames: GPS-I2C | VBAT | 3v3 | GND | SCL | SDA | SCL | SDA | 3v3 | GND | EarthPod Sensors & Power | - | CR1220 | SOLAR | - | + | + | GND / / GND / / LGT / / 3.3V | LIPO | VBAT | 3v3 | GND | SCL | SDA | ERR | LGT | CBAT | AI2 | AI1 | GI2 | GI1 | ERR | ON | CHG | VBAT | 3v3 | GND | SCL | SDA | ERR | LGT | CBAT | AI2 | AI1 | GI2 | GI1 | 3v3 | GND | S2 | S5 | T2 | T5 | PWR | USB-BAT | RESET | 3v3 / / GND / / RX / / TX | EarthPod Controller